# Altium project Jupiter.PrjPcb
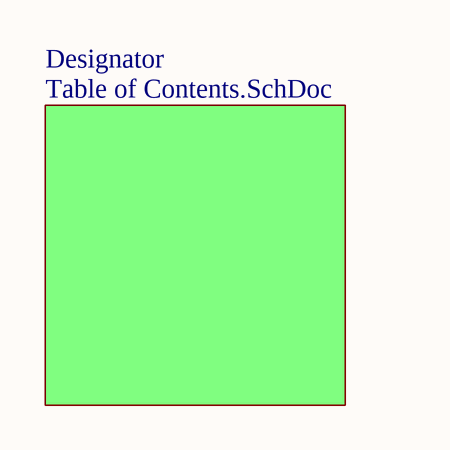
[diagram p0: Title Sheet.SchDoc]
9 sheets, 59 parts. Net scope: flat (ports and power ports of the same name join across sheets).
Board file: Jupiter PCB.PcbDoc
Sheets:
  Title Sheet.SchDoc
    Designator = Table of Contents.SchDoc
      Designator = Power Block Diagram.SchDoc
        Designator = Signal Block Diagram.SchDoc
          Designator = SOC nRF52832.SchDoc
          Designator = Sensors.SchDoc
          Designator = LED & Button.SchDoc
          Designator = Power Supply.SchDoc
          Designator = RTC.SchDoc

## Sheet Title Sheet.SchDoc
size A

### Sub-sheets
Designator = Table of Contents.SchDoc: no entries

## Sheet Table of Contents.SchDoc
size A
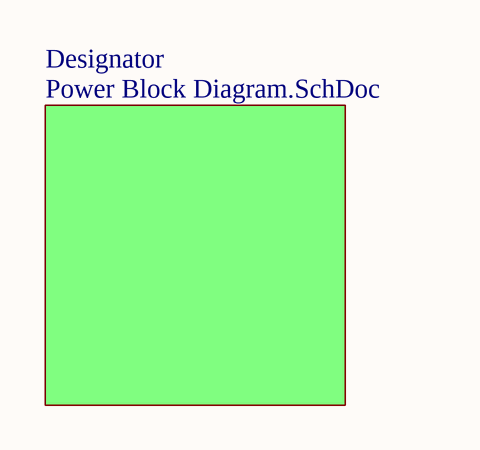
[diagram p1: Table of Contents.SchDoc]

### Sub-sheets
Designator = Power Block Diagram.SchDoc: no entries

## Sheet Power Block Diagram.SchDoc
size A
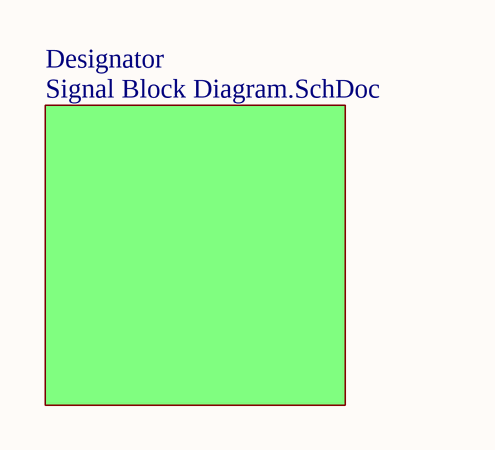
[diagram p2: Power Block Diagram.SchDoc]

### Sub-sheets
Designator = Signal Block Diagram.SchDoc: no entries

## Sheet Signal Block Diagram.SchDoc
size A
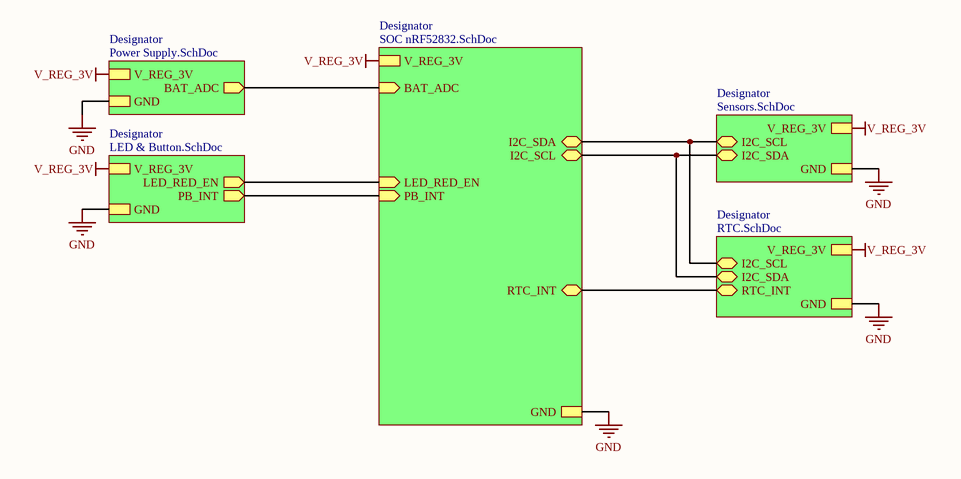
[diagram p3: Signal Block Diagram.SchDoc]

### Sub-sheets
Designator = SOC nRF52832.SchDoc: BAT_ADC (in), PB_INT (in), GND, V_REG_3V, I2C_SDA (bidir), I2C_SCL (bidir), RTC_INT (bidir), LED_RED_EN (in)
Designator = Sensors.SchDoc: GND, I2C_SDA (bidir), V_REG_3V, I2C_SCL (bidir)
Designator = LED & Button.SchDoc: GND, LED_RED_EN (out), PB_INT (out), V_REG_3V
Designator = Power Supply.SchDoc: GND, V_REG_3V, BAT_ADC (out)
Designator = RTC.SchDoc: GND, I2C_SDA (bidir), I2C_SCL (bidir), V_REG_3V, RTC_INT (bidir)

### Nets
GND: sheet Designator/GND, sheet Designator/GND, sheet Designator/GND, sheet Designator/GND, sheet Designator/GND
V_REG_3V: sheet Designator/V_REG_3V, sheet Designator/V_REG_3V, sheet Designator/V_REG_3V, sheet Designator/V_REG_3V, sheet Designator/V_REG_3V
(unnamed): sheet Designator/BAT_ADC, sheet Designator/BAT_ADC
(unnamed): sheet Designator/PB_INT, sheet Designator/PB_INT
(unnamed): sheet Designator/I2C_SDA, sheet Designator/I2C_SCL, sheet Designator/I2C_SCL
(unnamed): sheet Designator/I2C_SCL, sheet Designator/I2C_SDA, sheet Designator/I2C_SDA
(unnamed): sheet Designator/RTC_INT, sheet Designator/RTC_INT
(unnamed): sheet Designator/LED_RED_EN, sheet Designator/LED_RED_EN

## Sheet SOC nRF52832.SchDoc
size B
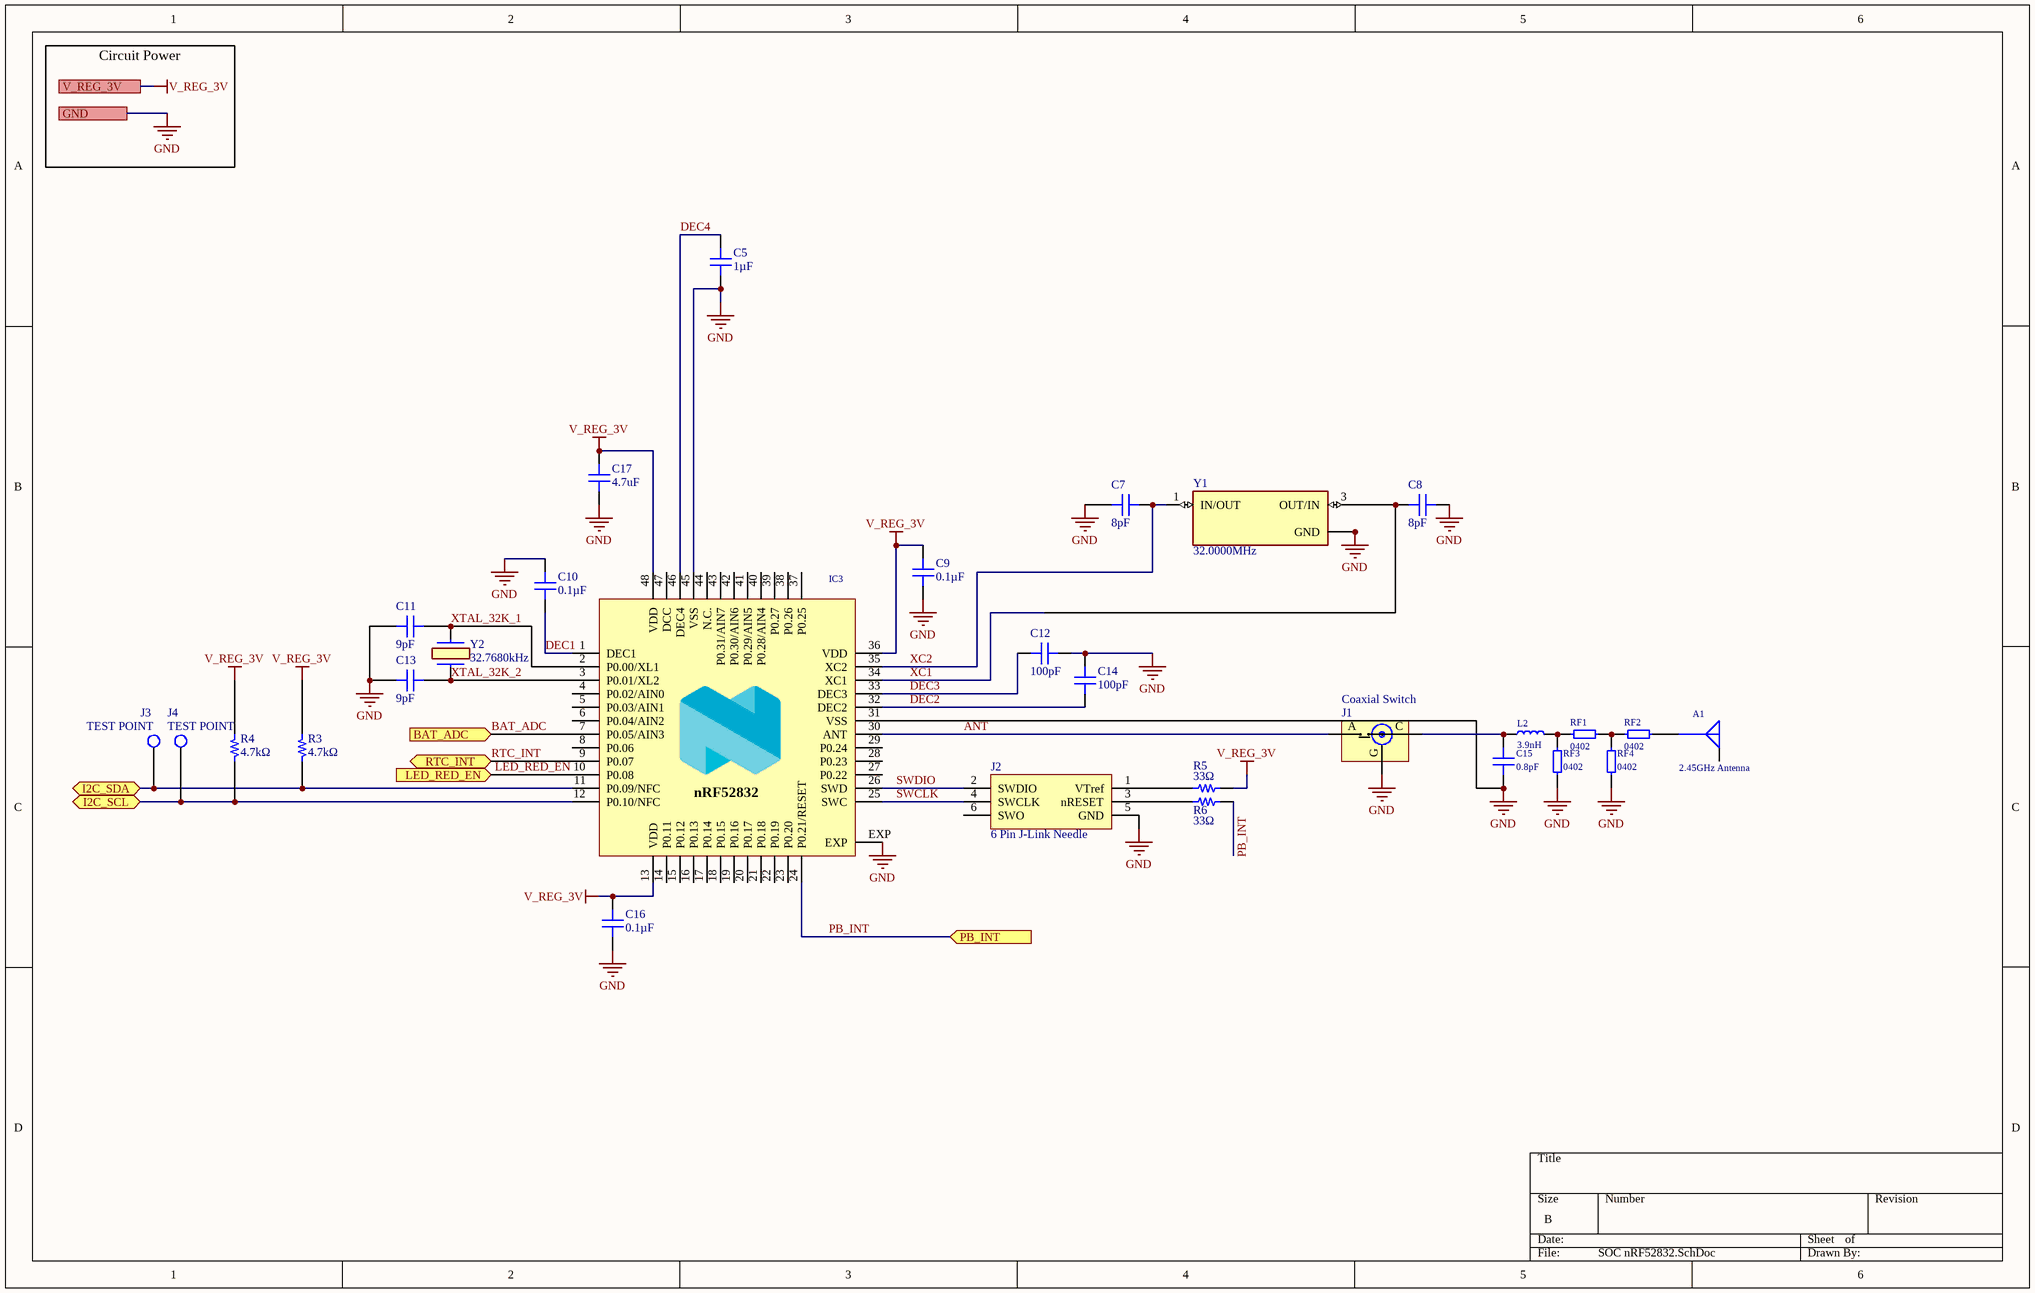
[diagram p4: SOC nRF52832.SchDoc]

### Parts
A1  2.45GHz Antenna  [FRACTUS ANTENNAS FR01-S1-N-0-102]
C5  1µF  [CAP 0402_1005 RF]
C7  8pF  [CAP 0402_1005]
C8  8pF  [CAP 0402_1005]
C9  0.1µF  [CAP 0402_1005]
C10  0.1µF  [CAP 0402_1005]
C11  9pF  [CAP 0402_1005]
C12  100pF  [CAP 0402_1005]
C13  9pF  [CAP 0402_1005]
C14  100pF  [CAP 0402_1005]
C15  0.8pF  [CAP 0603_1608]
C16  0.1µF  [CAP 0402_1005]
C17  4.7uF  [CAP 0402_1005]
IC3  RF SoC  [NORDIC QFN-48]  (value not drawn)
J1  Coaxial Switch  [HIROSE MS-156HF(01)]
J2  6 Pin J-Link Needle  [J-LINK 6-PIN NEEDLE]  (no BOM)
J3  TEST POINT  [TEST POINT]
J4  TEST POINT  [TEST POINT]
L2  3.9nH  [IND 0402_1005]
R3  4.7kΩ  [RES 0402_1005 RF]
R4  4.7kΩ  [RES 0402_1005 RF]
R5  33Ω  [RES 0201_0603]
R6  33Ω  [RES 0201_0603]
RF1  0402  [0402_1005 RF]  (no BOM)
RF2  0402  [0402_1005 RF]  (no BOM)
RF3  0402  [0402_1005 RF]  (no BOM)
RF4  0402  [0402_1005 RF]  (no BOM)
Y1  32.0000MHz  [ECS 320-8-37B]
Y2  32.7680kHz  [EPSON FC135R]

### Ports
BAT_ADC (in), GND, I2C_SCL (bidir), I2C_SDA (bidir), LED_RED_EN (in), PB_INT (in), RTC_INT (bidir), V_REG_3V

### Nets
GND: C5.1 C7.1 C8.2 C9.1 C10.2 C11.1 C12.2 C13.1 C14.2 C15.1 C16.1 C17.1 IC3.31(VSS) IC3.45(VSS) IC3.EXP J1.G J2.5(GND) RF3.1 RF4.1 Y1.2(GND) Y1.4(GND) ; port GND
V_REG_3V: C9.2 C16.2 C17.2 IC3.13(VDD) IC3.36(VDD) IC3.48(VDD) R3.2 R4.2 R5.2 ; port V_REG_3V
ANT: IC3.30(ANT) J1.A
BAT_ADC: IC3.7(P0.05/AIN3) ; port BAT_ADC
DEC1: C10.1 IC3.1(DEC1)
DEC2: C14.1 IC3.32(DEC2)
DEC3: C12.1 IC3.33(DEC3)
DEC4: C5.2 IC3.46(DEC4)
I2C_SCL: IC3.12(P0.10/NFC) J4.1(PAD) R4.1 ; port I2C_SCL
I2C_SDA: IC3.11(P0.09/NFC) J3.1(PAD) R3.1 ; port I2C_SDA
LED_RED_EN: IC3.10(P0.08) ; port LED_RED_EN
PB_INT: IC3.24(P0.21/RESET) R6.2 ; port PB_INT
RTC_INT: IC3.9(P0.07) ; port RTC_INT
SWCLK: IC3.25(SWC) J2.4(SWCLK)
SWDIO: IC3.26(SWD) J2.2(SWDIO)
XC1: C8.1 IC3.34(XC1) Y1.3(OUT/IN)
XC2: C7.2 IC3.35(XC2) Y1.1(IN/OUT)
XTAL_32K_1: C11.2 IC3.2(P0.00/XL1) Y2.1(CRYSTAL_1)
XTAL_32K_2: C13.2 IC3.3(P0.01/XL2) Y2.2(CRYSTAL_2)
NetA1_S: A1.S RF2.2
NetC15_2: C15.2 J1.C L2.1
NetJ2_1: J2.1(VTref) R5.1
NetJ2_3: J2.3(nRESET) R6.1
NetL2_2: L2.2 RF1.1 RF3.2
NetRF1_2: RF1.2 RF2.1 RF4.2

Not connected (* = marked no-connect by the designer): A1 G; IC3 4(P0.02/AIN0) 5(P0.03/AIN1) 6(P0.04/AIN2) 8(P0.06) 14(P0.11) 15(P0.12) 16(P0.13) 17(P0.14) 18(P0.15) 19(P0.16) 20(P0.17) 21(P0.18) 22(P0.19) 23(P0.20) 27(P0.22) 28(P0.23) 29(P0.24) 37(P0.25) 38(P0.26) 39(P0.27) 40(P0.28/AIN4) 41(P0.29/AIN5) 42(P0.30/AIN6) 43(P0.31/AIN7) 44(N.C.) 47(DCC); J2 6(SWO)

### Notes on the sheet
- Circuit Power
- (in symbol SOC00001) nRF52832

### Library data of the parts
A1 = ANT00000: COMPACT REACH XTEND - 102; Manufacturer: Ignion; Manufacturer P/N: NN01-102; RF Family/Standard: 802.15.4, Bluetooth, WiFi; Frequency Group: UHF (2GHz ~ 3GHz); Frequency Range: 2.4GHz ~ 2.5GHz; Antenna Type: Chip; VSWR: 2; Gain: 1.7dBi; Device ID: ANT00000; VALUE: 2.45GHz Antenna; Mounting Type: Surface Mount; Part Type: Chip; Operating Temperature: -40°C ~ 125°C; Package: 7mm; Frequency (Center/Band): 2.45GHz; Return Loss: -; Supplier1: Digi-Key; Supplier1 P/N: 2115-NN01-102CT-ND; Supplier2: Mouser; Supplier2 P/N: 128-NN01-102
C5 = CAP00027: CAP CER 1UF 10V X7S 0402; Manufacturer: Murata Electronics; Manufacturer P/N: GCM155C71A105ME38D; Tolerance: ±20%; Device ID: CAP00027; Mounting Type: Surface Mount; Part Type: Capacitor; VALUE: 1µF; Operating Temperature: -55°C ~ 125°C; Voltage: 10V; Package: 0402 (1005 Metric); Supplier1: Digi-Key; Supplier1 P/N: 490-18202-1-ND; Supplier2: Mouser; Supplier2 P/N: 81-GCM155C71A105ME8D; Temperature Coefficient: X7S
C7 C8 = CAP00054: CAP CER 8PF 50V NPO 0402; Manufacturer: Walsin; Manufacturer P/N: 0402N9R0B500CT; Tolerance: ±0.1%; Temperature Coefficient: C0G, NP0; Device ID: CAP00054; Mounting Type: Surface Mount; Part Type: Capacitor; VALUE: 8pF; Operating Temperature: -55°C ~ 125°C; Voltage: 50V; Package: 0402 (1005 Metric); Supplier1: Digi-Key; Supplier1 P/N: 1292-0402N9R0B500CTTR-ND; Supplier2: Mouser; Supplier2 P/N: 791-0402N9R0B500CT
C9 C10 C16 = CAP00001: CAP CER 0.1UF 16V X7R 0402; Manufacturer: KEMET; Manufacturer P/N: C0402C104K4RAC7411; Tolerance: ±10%; Device ID: CAP00001; Mounting Type: Surface Mount; Part Type: Capacitor; VALUE: 0.1µF; Operating Temperature: -55°C ~ 125°C; Voltage: 16V; Package: 0402 (1005 Metric); Supplier1: Digi-Key; Supplier1 P/N: 399-C0402C104K4RAC7411CT-ND; Supplier2: Mouser; Supplier2 P/N: 80-C0402C104K4R7411; Temperature Coefficient: X7R
C11 C13 = CAP0004E: CAP CER 9PF 50V NPO 0402; Manufacturer: Walsin; Manufacturer P/N: 0402N9R0B500CT; Tolerance: ±0.1%; Temperature Coefficient: C0G, NP0; Device ID: CAP0004E; Mounting Type: Surface Mount; Part Type: Capacitor; VALUE: 9pF; Operating Temperature: -55°C ~ 125°C; Voltage: 50V; Package: 0402 (1005 Metric); Supplier1: Digi-Key; Supplier1 P/N: 1292-0402N9R0B500CTTR-ND; Supplier2: Mouser; Supplier2 P/N: 791-0402N9R0B500CT
C12 C14 = CAP00000: CAP CER 100PF 16V C0G/NP0 0402; Manufacturer: KEMET; Manufacturer P/N: C0402C101K4GACTU; Tolerance: ±10%; Temperature Coefficient: C0G, NP0; Device ID: CAP00000; Mounting Type: Surface Mount; Part Type: Capacitor; VALUE: 100pF; Operating Temperature: -55°C ~ 125°C; Voltage: 16V; Package: 0402 (1005 Metric); Supplier1: Digi-Key; Supplier1 P/N: 399-7749-1-ND; Supplier2: Mouser; Supplier2 P/N: 80-C0402C101K4G
C15 = CAP0004D: CAP CER 0.8PF 50V NP0  0603; Manufacturer: Walsin; Manufacturer P/N: 0603N0R8C500CT; Tolerance: ±0.25pF; Temperature Coefficient: C0G, NP0; Device ID: CAP0004D; Mounting Type: Surface Mount; Part Type: Capacitor; VALUE: 0.8pF; Operating Temperature: -55°C ~ 125°C; Voltage: 50V; Package: 0603 (1608 Metric); Supplier2: Mouser; Supplier2 P/N: 791-0603N0R8C500CT
C17 = CAP00055: CAP CER 8PF 50V NPO 0402; Manufacturer: Samsung Electro-Mechanics; Manufacturer P/N: CL05A475KQ5NRNC; Voltage: 10V; Tolerance: ±10%; Temperature Coefficient: X5R; Device ID: CAP00055; Mounting Type: Surface Mount; Part Type: Capacitor; VALUE: 4.7uF; Operating Temperature: -55°C ~ 125°C; Package: 0402 (1005 Metric); Supplier1: Digi-Key; Supplier1 P/N: 187-CL05A475KQ5NRNC; Supplier2: Mouser; Supplier2 P/N: 187-CL05A475KQ5NRNC
IC3 = SOC00001: IC RF TXRX+MCU BLUETOOTH 48VFQFN; Manufacturer: Nordic Semiconductor; Manufacturer P/N: nRF52832-QFAA-R; Current - Transmitting: 5.5mA ~ 15.2mA; Voltage Supply: 1.7V ~ 3.6V; Sensitivity: -96dBm; Power Output: 4dBm; Frequency: 2.4GHz; Data Rate (Max): 2Mbps; Current - Receiving: 5.5mA ~ 10.4mA; GPIO: 32; Memory Size: 512kB Flash, 64kB RAM; Device ID: SOC00001; Part Type: IC; VALUE: RF SoC; Operating Temperature: -40°C ~ 85°C; Package: QFN-48; Supplier1: Digi-Key; Supplier1 P/N: 1490-1052-1-ND; Supplier2: Digi-Key; Supplier2 P/N: 1490-1067-1-ND; Mounting Type: Surface Mount; Supplier3: Mouser; Supplier3 P/N: 949-NRF52832-QFAA-R7
J1 = RFC00001: CONN COAX SWITCH RCPT STR 50OHM; Manufacturer: Hirose Electric Co Ltd; Manufacturer P/N: MS-156HF(01); Connector Type: Receptacle, Female Socket; Contact Termination: Solder; Impedance: 50Ω; Mating Cycles: 100; Frequency - Max: 6GHz; Device ID: RFC00001; VALUE: Coaxial Switch; Mounting Type: Surface Mount; Part Type: RF Connector; Operating Temperature: -40°C ~ 85°C; Package: Coaxial Switch; Connector Style: MS-156HF(01); Shield Termination: Solder; Cable Group: -; Fastening Type: Snap-On; Supplier1: Digi-Key; Supplier1 P/N: H11669-ND; Supplier2: Mouser; Supplier2 P/N: 798-MS156HF01
J2 = J-LINK 6-PIN NEEDLE ADAPTER: Device ID: CON00004; Connector Type: Board; Style: On-Board; Number of Positions: 6; Number of Positions Loaded: All; Pitch - Mating: 0.050" (1.27mm); VALUE: 6 Pin J-Link Needle; Mounting Type: Board Connector; Part Type: Header; Manufacturer: -; Manufacturer P/N: -; Operating Temperature: -; Package: N/A; Contact Type: Pogo-Pins; Fastening Type: -; Contact Finish - Mating: -; Insulation Color: -; Material Flammability Rating: -; Current Rating (Amps): -; Voltage Rating: -; Supplier1: -; Supplier1 P/N: -; Supplier2: -; Supplier2 P/N: --
J3 J4 = -: Device ID: CON00015; Connector Type: Pad; Number of Positions: 1; Number of Positions Loaded: All; VALUE: Test Point; Mounting Type: Surface Mount; Part Type: Header; Manufacturer: -; Manufacturer P/N: -; Operating Temperature: -; Package: -; Contact Type: Pad; Style: Pad; Pitch - Mating: -; Fastening Type: -; Contact Finish - Mating: Gold; Insulation Color: -; Material Flammability Rating: -; Current Rating (Amps): -; Voltage Rating: -; Supplier1: -; Supplier1 P/N: -; Supplier2: -; Supplier2 P/N: -
L2 = IND00004: FIXED IND 3.9NH 250MA 450MOHM SM; Manufacturer: KYOCERA AVX; Manufacturer P/N: L04023R9BHNTR; Tolerance: ±0.1%; DC Resistance: 0.460Ω; Q @ Freq: 13 @ 450MHz; Material - Core: Non-Magnetic; Frequency - Self Resonant: 8GHz; Device ID: IND00004; Part Type: Inductor; VALUE: 3.9nH; Operating Temperature: -55°C ~ 125°C; Current Saturation: -; Package: 0402 (1005 Metric); Supplier1: Digi-Key; Supplier1 P/N: 478-4199-2-ND; Supplier2: Mouser; Supplier2 P/N: 581-L04023R9BHNTR; Mounting Type: Surface Mount
R3 R4 = RES0003B: RES SMD 4.7K OHM 1% 1/8W 0402; Manufacturer: YAGEO; Manufacturer P/N: AC0402FR-7W4K7L; Power: 0.125W; Device ID: RES0003B; VALUE: 4.7kΩ; Mounting Type: Surface Mount; Part Type: Resistor; Operating Temperature: -55°C ~ 155°C; Package: 0402 (1005 Metric); Tolerance: ±1%; Composition: Thick Film; Supplier1: Digi-Key; Supplier1 P/N: 603-AC0402FR-7W4K7L; Supplier2: Mouser; Supplier2 P/N: 603-AC0402FR-7W4K7L
R5 R6 = RES0003A: RES SMD 33 OHM 1% 1/20W 0201; Manufacturer: Vishay Dale; Manufacturer P/N: CRCW020110R0FNED; Power: 0.050W; Device ID: RES0003A; VALUE: 33Ω; Mounting Type: Surface Mount; Part Type: Resistor; Operating Temperature: -55°C ~ 155°C; Package: 0201 (0603 Metric); Tolerance: ±1%; Composition: Thick Film; Supplier1: Digi-Key; Supplier1 P/N: 541-10.0ABCT-ND; Supplier2: Mouser; Supplier2 P/N: 71-CRCW020110R0FNED
RF1-RF4 = RFP00000: 0402 RF Passive; Device ID: RFP00000; VALUE: 0402; Mounting Type: Surface Mount; Part Type: Passive
Y1 = XTL00005: CRYSTAL 32.0000MHZ 8PF SMD; Manufacturer: ECS; Manufacturer P/N: ECS-320-8-37B-7KM-TR3; Tolerance: ±7ppm; Operating Mode: Fundamental; ESR: 50Ω; Device ID: XTL00005; Part Type: XTAL; VALUE: 32.0000MHz; Operating Temperature: -20°C ~ 70°C; Load Capacitance: 8pF; Package: 4-SMD, No Lead; Supplier1: Digi-Key; Supplier1 P/N: 50-ECS-320-8-37B-7KM-TR3TR-ND; Supplier2: Mouser; Supplier2 P/N: 520-ECS320837B7KMTR3 / 729-G43270021; Mounting Type: Surface Mount
Y2 = XTL00004: CRYSTAL 32.7680KHZ 9PF SMD; Manufacturer: EPSON; Manufacturer P/N: FC-135R 32.7680KF-AC3; Tolerance: ±10ppm; Operating Mode: Fundamental; ESR: 50kΩ; Device ID: XTL00004; Part Type: XTAL; VALUE: 32.7680kHz; Operating Temperature: -20°C ~ 70°C; Load Capacitance: 9pF; Package: 2-SMD, No Lead; Supplier1: Digi-Key; Supplier1 P/N: SER4075TR-ND; Supplier2: Mouser; Supplier2 P/N: 732-5R32.7680KF-AC3 / 729-G43270021; Mounting Type: Surface Mount

## Sheet Sensors.SchDoc
size A
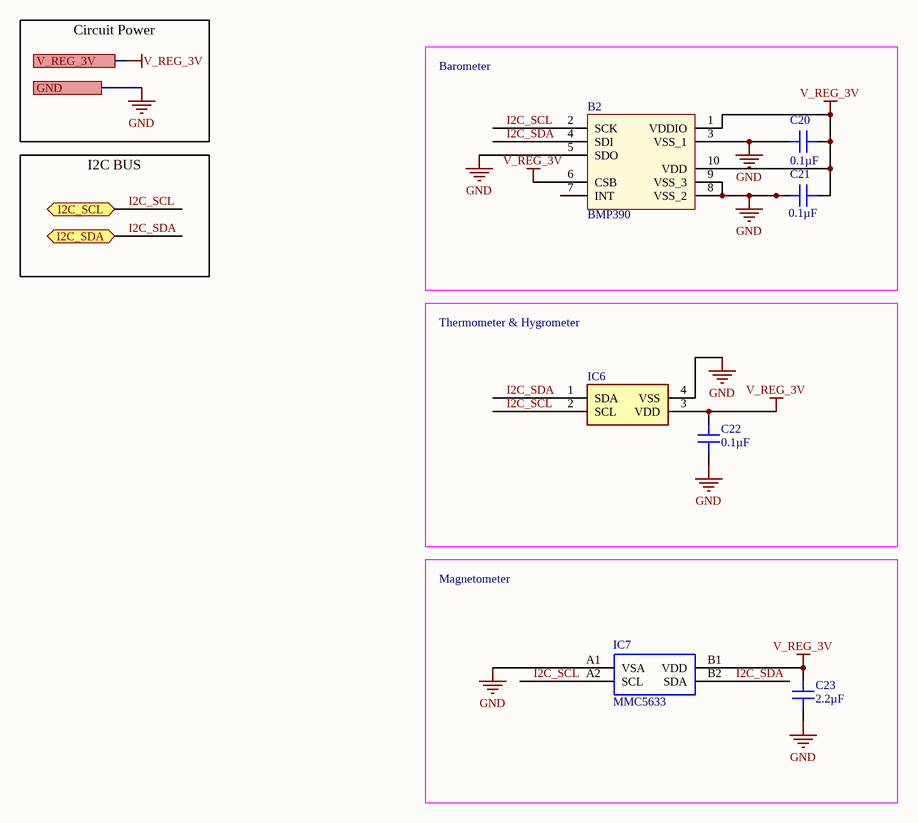
[diagram p5: Sensors.SchDoc]

### Parts
B2  BMP390  [BMP390]
C20  0.1µF  [CAP 0603_1608 RF]
C21  0.1µF  [CAP 0603_1608 RF]
C22  0.1µF  [CAP 0402_1005]
C23  2.2µF  [CAP 0402_1005 RF]
IC6  -40°C ~ 125°C Temp Sense  [SENSIRION SHT45]  (value not drawn)
IC7  MMC5633  [MEMSIC MMC5633]

### Blocks framed on the sheet
Barometer: B2 C20 C21
Thermometer & Hygrometer: C22 IC6
Magnetometer: C23 IC7

### Ports
GND, I2C_SCL (bidir), I2C_SDA (bidir), V_REG_3V

### Nets
GND: B2.3(VSS_1) B2.5(SDO) B2.8(VSS_2) B2.9(VSS_3) C20.1 C21.1 C22.1 C23.1 IC6.4(VSS) IC7.A1(VSA) ; port GND
V_REG_3V: B2.1(VDDIO) B2.6(CSB) B2.10(VDD) C20.2 C21.2 C22.2 C23.2 IC6.3(VDD) IC7.B1(VDD) ; port V_REG_3V
I2C_SCL: B2.2(SCK) IC6.2(SCL) IC7.A2(SCL) ; port I2C_SCL
I2C_SDA: B2.4(SDI) IC6.1(SDA) IC7.B2(SDA) ; port I2C_SDA

Not connected (* = marked no-connect by the designer): B2 7(INT)

### Notes on the sheet
- Circuit Power
- I2C BUS

### Library data of the parts
B2 = TMP00004: PRESSURE; Manufacturer_Name: Bosch Sensortec; Manufacturer: BOSCH; Geometry.Height: 0.8mm; VALUE: -40°C ~ 125°C Temp Sense; Sensor Type: Digital, Local; Sensing Temperature - Local: -40°C ~ 125°C; Output Type: I²C/SMBus; Voltage - Supply: 1.08V ~ 3.6V; Resolution: 16B; Accuracy - Highest (Lowest): ±2°C (±3°C); Test Condition: -10°C ~ 100°C (-40°C ~ 125°C); Mouser Part Number: 262-BMP390; Mouser Price/Stock: https://www.mouser.co.uk/ProductDetail/Bosch-Sensortec/BMP390?qs=QNEnbhJQKvYQVfvRMgo2YA%3D%3D; Manufacturer_Part_Number: BMP390; Datasheet Link: https://www.bosch-sensortec.com/media/boschsensortec/downloads/datasheets/bst-bmp390-ds002.pdf; Device ID: TMP00004; Part Type: IC; Manufacturer P/N: BMP390; Operating Temperature: -40°C ~ 125°C; Package: 10-DFN; Mounting Type: Surface Mount; Sensing Temperature - Remote: -; Features: One-Shot, Shutdown Mode; Supplier1: Digi-Key; Supplier1 P/N: 403-SHT45-AD1B-R3; Supplier2: Mouser; Supplier2 P/N: 1649-SHT45-AD1B-R3TR-ND
C20 C21 = CAP00039: CAP CER 0.1UF 16V X7R 0603; Manufacturer: KEMET; Manufacturer P/N: C0603C104M4RACAUTO; Tolerance: ±20%; Device ID: CAP00039; Mounting Type: Surface Mount; Part Type: Capacitor; VALUE: 0.1µF; Operating Temperature: -55°C ~ 125°C; Voltage: 16V; Package: 0603 (1608 Metric); Supplier1: Digi-Key; Supplier1 P/N: 399-C0603C104M4RACAUTOCT-ND; Supplier2: Mouser; Supplier2 P/N: C0603C104M4RACAUTO; Temperature Coefficient: X7R
C22 = CAP00001: as C9 on sheet SOC nRF52832; Device ID: CAP00001; Mounting Type: Surface Mount; Part Type: Capacitor; VALUE: 0.1µF; Operating Temperature: -55°C ~ 125°C; Voltage: 16V; Package: 0402 (1005 Metric); Supplier1: Digi-Key; Supplier1 P/N: 399-C0402C104K4RAC7411CT-ND; Supplier2: Mouser; Supplier2 P/N: 80-C0402C104K4R7411; Temperature Coefficient: X7R
C23 = CAP00028: CAP CER 2.2UF 10V X7S 0402; Manufacturer: Murata Electronics; Manufacturer P/N: GRT155C71A225KE13D; Tolerance: ±10%; Device ID: CAP00028; Mounting Type: Surface Mount; Part Type: Capacitor; VALUE: 2.2µF; Operating Temperature: -55°C ~ 125°C; Voltage: 10V; Package: 0402 (1005 Metric); Supplier1: Digi-Key; Supplier1 P/N: 490-16304-1-ND; Supplier2: Mouser; Supplier2 P/N: 81-GRT155C71A225KE3D; Temperature Coefficient: X7S
IC6 = TMP00003: SENSOR HUMID/TEMP HIGH ACCURACY; Manufacturer: Sensirion AG; Manufacturer P/N: SHT45-AD1B-R3; Sensor Type: Digital, Local; Output Type: I²C/SMBus; Voltage - Supply: 1.08V ~ 3.6V; Resolution: 16B; Accuracy - Highest (Lowest): ±2°C (±3°C); Test Condition: -10°C ~ 100°C (-40°C ~ 125°C); Device ID: TMP00003; Part Type: IC; VALUE: -40°C ~ 125°C Temp Sense; Operating Temperature: -40°C ~ 125°C; Package: 4-DFN; Mounting Type: Surface Mount; Sensing Temperature - Local: -40°C ~ 125°C; Sensing Temperature - Remote: -; Features: One-Shot, Shutdown Mode; Supplier1: Digi-Key; Supplier1 P/N: 403-SHT45-AD1B-R3; Supplier2: Mouser; Supplier2 P/N: 1649-SHT45-AD1B-R3TR-ND
IC7 = MAG00002: 30 GAUSS, MONOLITHIC, HIGH PERFO; Manufacturer: MEMSIC; Manufacturer P/N: MMC5633NJL; VALUE: Magnetoresistive Sensor X, Y, Z Axis; Axis: Triple; Output Type: I²C; Sensing Range: ±3mT; Voltage - Supply: 1.62V ~ 3.6V; Current - Supply (Max): 0.4µA (Typ); Resolution: 20b; Bandwidth: 1kKz; Device ID: MAG00002; Part Type: IC; Package: BGA-2x2; Mounting Type: Surface Mount; Operating Temperature: -40°C ~ 125°C (TA); Technology: Hall Effect; Current - Output (Max): -; Features: Temperature Compensated; Supplier1: Digi-Key; Supplier1 P/N: 1267-MMC5633NJLTR-ND; Supplier2: Mouser; Supplier2 P/N: 438-MMC5633NJL

## Sheet LED & Button.SchDoc
size A
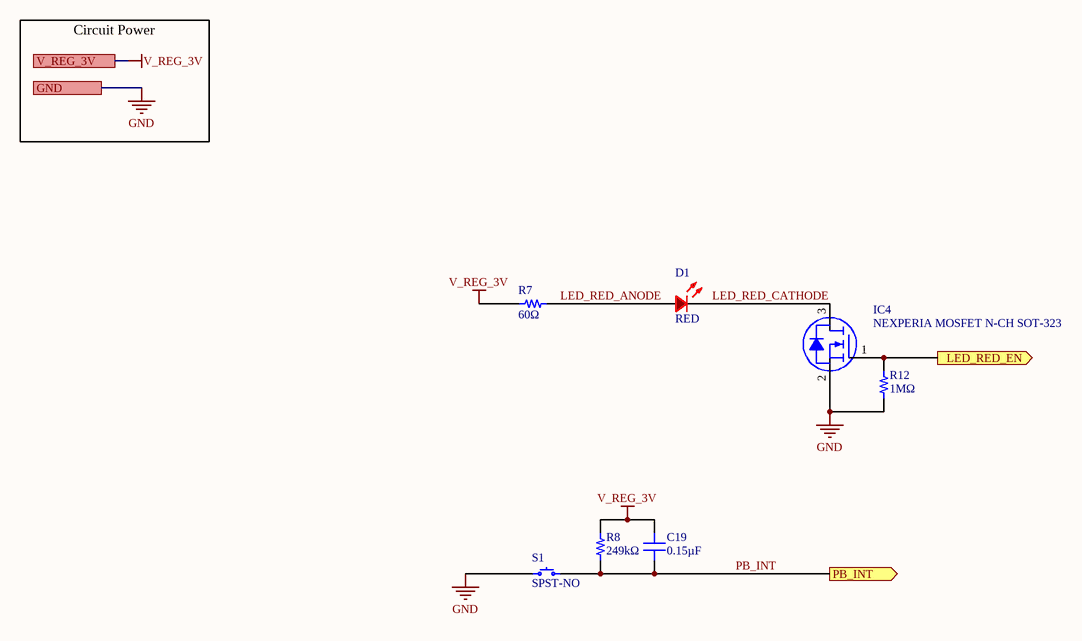
[diagram p6: LED & Button.SchDoc]

### Parts
C19  0.15µF  [CAP 0603_1608]
D1  RED  [LED 0603_1608]
IC4  NEXPERIA MOSFET N-CH SOT-323  [NEXPERIA SOT-323]
R7  60Ω  [RES 0603_1608 RF]
R8  249kΩ  [RES 0603_1608 RF]
R12  1MΩ  [RES 0603_1608 RF]
S1  SPST-NO  [PANASONIC EVP-AA002K]

### Ports
GND, LED_RED_EN (out), PB_INT (out), V_REG_3V

### Nets
GND: IC4.2(S) R12.1 S1.1 ; port GND
V_REG_3V: C19.2 R7.1 R8.2 ; port V_REG_3V
LED_RED_ANODE: D1.1 R7.2
LED_RED_CATHODE: D1.2 IC4.3(D)
LED_RED_EN: IC4.1(G) R12.2 ; port LED_RED_EN
PB_INT: C19.1 R8.1 S1.2 ; port PB_INT

### Notes on the sheet
- Circuit Power

### Library data of the parts
C19 = CAP00008: CAP CER 0.15UF 10V X7R 0603; Manufacturer: KEMET; Manufacturer P/N: C0603C154K8RACTU; Tolerance: ±10%; Device ID: CAP00008; Mounting Type: Surface Mount; Part Type: Capacitor; VALUE: 0.15µF; Operating Temperature: -55°C ~ 125°C; Voltage: 10V; Package: 0603 (1608 Metric); Supplier1: Digi-Key; Supplier1 P/N: 399-7862-1-ND; Supplier2: Mouser; Supplier2 P/N: 80-C0603C154K8R; Temperature Coefficient: X7R
D1 = LED0000A: LED RED CLEAR 0603 SMD; Manufacturer: Würth Elektronik; Manufacturer P/N: 150060RS75000; If - Forward Current: 100mA; Vf - Forward Voltage: 2.0V; Wavelength: 625nm; Viewing Angle: 140°; Lens Color: Colorless; Device ID: LED0000A; VALUE: RED; Mounting Type: Surface Mount; Part Type: LED; Operating Temperature: -40°C ~ 85°C; Package: 0603 (1608 Metric); Color: Red; Supplier1: Digi-Key; Supplier1 P/N: 732-4978-1-ND
IC4 = MOS00000: MOSFET N-CH 60V 320MA SOT323; Manufacturer: Nexperia USA Inc.; Manufacturer P/N: BSS138PW,115; FET Type: N-Channel; VALUE: NFET; Current - Continuous Drain (Id) @ 25°C: 320mA (Ta); Drive Voltage (Max Rds On, Min Rds On): 10V; Rds On (Max) @ Id, Vgs: 1.6Ohm @ 300mA, 10V; Vgs(th) (Max) @ Id: 1.5V @ 250µA; Vgs (Max): ±20V; Power Dissipation (Max): 260mW (Ta), 830mW (Tc); Gate Charge (Qg) (Max) @ Vgs: 0.8 nC @ 4.5 V; Input Capacitance (Ciss) (Max) @ Vds: 50 pF @ 10 V; Device ID: MOS00000; Package: SOT-323; Part Type: IC; Technology: MOSFET (Metal Oxide); FET Feature: -; Operating Temperature: -55°C ~ 150°C (TA); Mounting Type: Surface Mount; Drain to Source Voltage (Vdss): 60V; Supplier1: Digi-Key; Supplier1 P/N: 1727-1143-1-ND; Supplier2: Mouser; Supplier2 P/N: 771-BSS138PW115
R7 = RES00034: RES 60 OHM 1% 1/10W 0603; Manufacturer: Vishay Dale; Manufacturer P/N: ‎CRCW0603820KFKEAC‎; Power: 0.100W; Device ID: RES00034; VALUE: 60Ω; Mounting Type: Surface Mount; Part Type: Resistor; Operating Temperature: -55°C ~ 155°C; Package: 0603 (1608 Metric); Tolerance: ±1%; Composition: Thick Film; Supplier1: Digi-Key; Supplier1 P/N: ‎541-5568-1-ND‎; Supplier2: Mouser; Supplier2 P/N: 71-CRCW0603820KFKEAC
R8 = RES0000A: RES SMD 249K OHM 0.1% 1/10W 0603; Manufacturer: Susumu; Manufacturer P/N: RG1608P-2493-B-T5; Power: 0.100W; Device ID: RES0000A; VALUE: 249kΩ; Mounting Type: Surface Mount; Part Type: Resistor; Operating Temperature: -55°C ~ 155°C; Package: 0603 (1608 Metric); Tolerance: ±0.1%; Composition: Thin Film; Supplier1: Digi-Key; Supplier1 P/N: RG16P249KBCT-ND; Supplier2: Mouser; Supplier2 P/N: 754-RG1608P-2493-BT5
R12 = RES0003E: RES 1M OHM 1% 1/10W 0603; Manufacturer: Vishay Dale; Manufacturer P/N: ‎CRCW0603820KFKEAC‎; Power: 0.100W; Device ID: RES0003E; VALUE: 1MΩ; Mounting Type: Surface Mount; Part Type: Resistor; Operating Temperature: -55°C ~ 155°C; Package: 0603 (1608 Metric); Tolerance: ±1%; Composition: Thick Film; Supplier1: Digi-Key; Supplier1 P/N: ‎541-5568-1-ND‎; Supplier2: Mouser; Supplier2 P/N: 71-CRCW0603820KFKEAC
S1 = BUT00002: SWITCH TACTILE SPST-NO 0.02A 15V; Manufacturer: Panasonic Electronic Components; Manufacturer P/N: EVP-AA002K; Switch Function: Off-Mom; Contact Rating @ Voltage: 0.02A @ 15VDC; Operating Force: 100gf; Device ID: BUT00002; Part Type: Button; VALUE: SPST-NO; Operating Temperature: -40°C ~ 85°C; Package: 4-Lead SMT; Supplier1: Digi-Key; Supplier1 P/N: P13347SCT-ND; Supplier2: Mouser; Supplier2 P/N: 667-EVP-AA002K; Mounting Type: Surface Mount

## Sheet Power Supply.SchDoc
size A
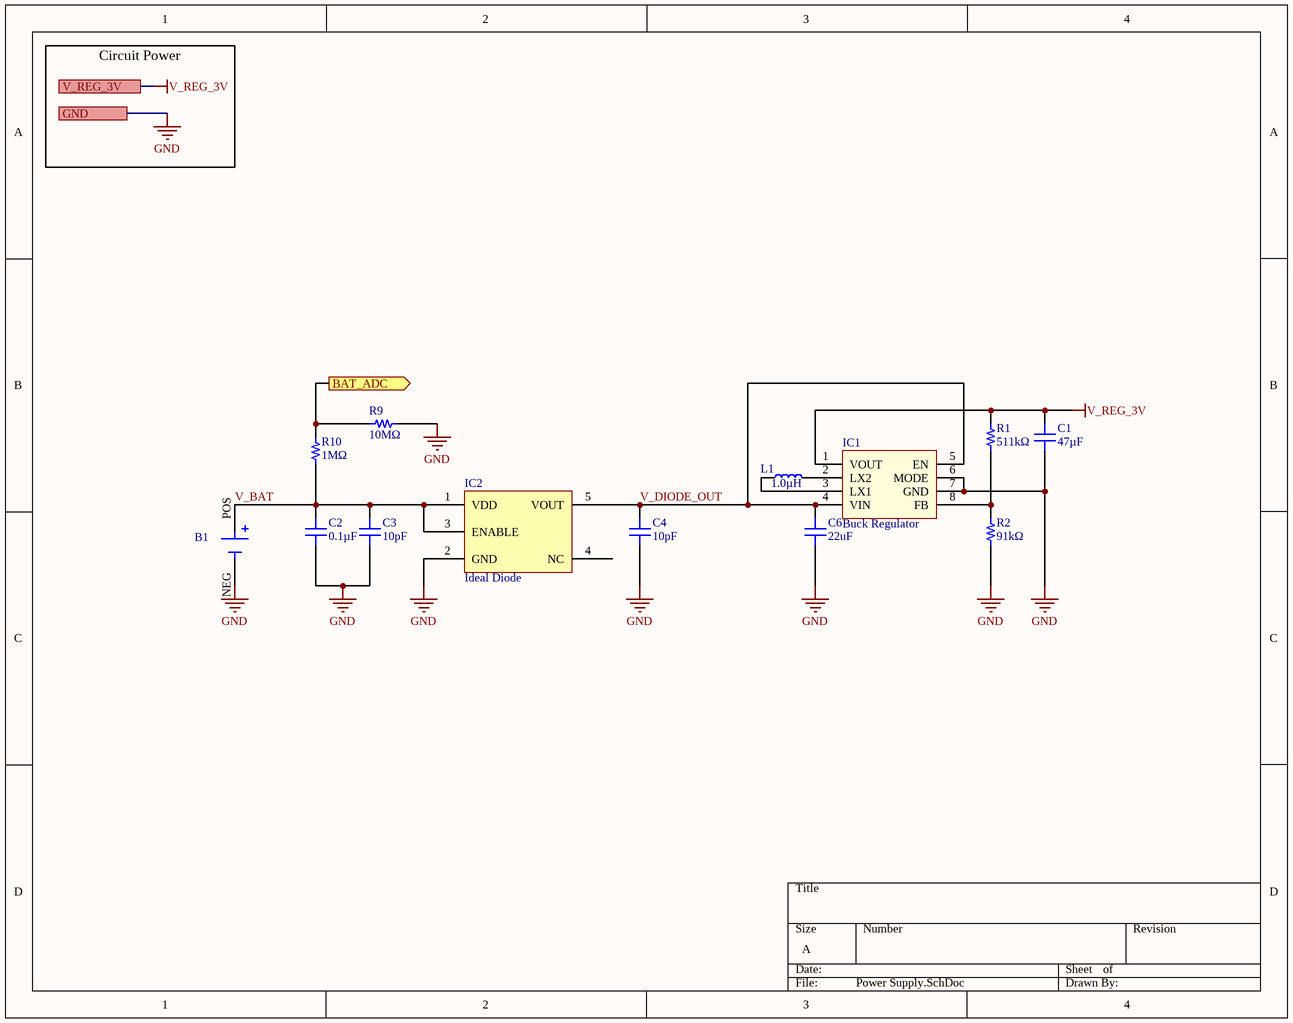
[diagram p7: Power Supply.SchDoc]

### Parts
B1  24.5mm Coin Cell (×1)  [MPD BHAA-3]  (value not drawn)
C1  47µF  [CAP 0805_2012]
C2  0.1µF  [CAP 0402_1005]
C3  10pF  [CAP 0603_1608]
C4  10pF  [CAP 0603_1608]
C6  22uF  [CAP 0402_1005]
IC1  Buck Regulator  [TI SOT-583]
IC2  Ideal Diode  [MAXIM SOT-23-5]
L1  1.0µH  [NTC 0603_1608]
R1  511kΩ  [RES 0402_1005 RF]
R2  91kΩ  [RES 0402_1005 RF]
R9  10MΩ  [RES 0603_1608 RF]
R10  1MΩ  [RES 0603_1608 RF]

### Ports
BAT_ADC (out), GND, V_REG_3V

### Nets
GND: B1.NEG C1.1 C2.1 C3.1 C4.1 C6.1 IC1.6(MODE) IC1.7(GND) IC2.2(GND) R2.1 R9.2 ; port GND
V_REG_3V: C1.2 IC1.1(VOUT) R1.2 ; port V_REG_3V
BAT_ADC: R9.1 R10.2 ; port BAT_ADC
V_BAT: B1.POS C2.2 C3.2 IC2.1(VDD) IC2.3(ENABLE) R10.1
V_DIODE_OUT: C4.2 C6.2 IC1.4(VIN) IC1.5(EN) IC2.5(VOUT)
NetIC1_2: IC1.2(LX2) L1.2
NetIC1_3: IC1.3(LX1) L1.1
NetIC1_8: IC1.8(FB) R1.1 R2.2

Not connected (* = marked no-connect by the designer): IC2 4(NC)

### Notes on the sheet
- Circuit Power

### Library data of the parts
B1 = BCL00006: BATTERY HOLDER AA PIN; Manufacturer: MPD (Memory Protection Devices); Manufacturer P/N: BHAA-3‎; Number of Cells: 1; Style: PC Pin; Device ID: BCL00006; Part Type: Battery Holder; VALUE: 24.5mm Coin Cell (×1); Operating Temperature: -55°C ~ 105°C; Battery Cell Size: AA; Supplier1: Digi-Key; Supplier1 P/N: BHAA-3-ND; Supplier2: -; Supplier2 P/N: -; Mounting Type: Through Hole
C1 = CAP00052: CAP CER 47UF 50V X7R 0805; Manufacturer: KEMET; Manufacturer P/N: C0805C223K5RAC7210; Tolerance: ±20%; Device ID: CAP00052; Mounting Type: Surface Mount; Part Type: Capacitor; VALUE: 47µF; Operating Temperature: -55°C ~ 125°C; Voltage: 50V; Package: 0805 (2012 Metric); Supplier1: Digi-Key; Supplier1 P/N: 399-C0805C223K5RAC7210CT-ND; Supplier2: Mouser; Supplier2 P/N: 80-C0805C223K5RACLR; Temperature Coefficient: X7R
C2 = CAP00001: as C9 on sheet SOC nRF52832; Device ID: CAP00001; Mounting Type: Surface Mount; Part Type: Capacitor; VALUE: 0.1µF; Operating Temperature: -55°C ~ 125°C; Voltage: 16V; Package: 0402 (1005 Metric); Supplier1: Digi-Key; Supplier1 P/N: 399-C0402C104K4RAC7411CT-ND; Supplier2: Mouser; Supplier2 P/N: 80-C0402C104K4R7411; Temperature Coefficient: X7R
C3 C4 = CAP00050: CAP CER 10UF 6.3V X5R 0603; Manufacturer: KEMET; Manufacturer P/N: CL10A106MQ8NNNC; Tolerance: ±20%; Device ID: CAP00050; Mounting Type: Surface Mount; Part Type: Capacitor; VALUE: 10pF; Operating Temperature: -55°C ~ 125°C; Voltage: 6.3V; Package: 0603 (1608 Metric); Supplier1: Digi-Key; Supplier1 P/N: 1276-1119-2-ND; Supplier2: Mouser; Supplier2 P/N: 187-CL10A106MQ8NNNC; Temperature Coefficient: X5R
C6 = CAP00053: CAP CER 22UF 50V NPO 0402; Manufacturer: Walsin; Manufacturer P/N: 0402N9R0B500CT; Tolerance: ±0.1%; Temperature Coefficient: C0G, NP0; Device ID: CAP00053; Mounting Type: Surface Mount; Part Type: Capacitor; VALUE: 22uF; Operating Temperature: -55°C ~ 125°C; Voltage: 50V; Package: 0402 (1005 Metric); Supplier1: Digi-Key; Supplier1 P/N: 1292-0402N9R0B500CTTR-ND; Supplier2: Mouser; Supplier2 P/N: 791-0402N9R0B500CT
IC1 = VRG00007: DC DC CONVERTER; Manufacturer: Texas Instruments; Manufacturer P/N: TPS631000DRLR; Voltage - Input (Max): 5.5V; Voltage - Input (Min): 1.6V; Voltage - Output (Max): 5.3V; Current - Output: 2A; Number of Outputs: 1; Voltage - Output (Min/Fixed): 1.2V; Function: Step-Down; Device ID: VRG00007; Part Type: IC; VALUE: Buck Regulator; Operating Temperature: -40°C ~ 125°C (TJ); Package: SOT-583; Supplier1: Digi-Key; Supplier1 P/N: 296-TPS631000DRLRTR-ND; Synchronous Rectifier: -; Supplier2: Mouser; Supplier2 P/N: 595-TPS631000DRLR; Mounting Type: Surface Mount; Frequency - Switching: -
IC2 = DCN00002: IC IDEAL DIODE; Manufacturer: Texas Instruments; Manufacturer P/N: LM66100DCKR; FET Type: P-Channel; Ratio - Input:Output: 1:1; Internal Switch(s): Yes; Current - Output (Max): 1.5A; Voltage - Supply: 1.5V ~ 5.5V; Delay Time - ON: 27 µs; Delay Time - OFF: 2 µs; Device ID: DCN00002; Part Type: IC; VALUE: Ideal Diode; Operating Temperature: -40°C ~ 105°C; Package: SOT-363; Mounting Type: Surface Mount; Applications: General Purpose; Supplier1: Digi-Key; Supplier1 P/N: 296-53541-1-ND; Supplier2: Mouser; Supplier2 P/N: 595-LM66100DCKR
L1 = IND00005: FIXED IND 1.0UH 16V; Manufacturer: TDK Corporation; Manufacturer P/N: C2012X5R1C106K; Current Saturation: 90mA; Tolerance: ±20%; DC Resistance: 1.050Ω; Material - Core: Ferrite; Device ID: IND00005; Part Type: Inductor; VALUE: 1.0µH; Operating Temperature: -55°C ~ 125°C; Package: 0603 (1608 Metric); Supplier1: Digi-Key; Supplier1 P/N: 445-175588-1-ND; Supplier2: Mouser; Supplier2 P/N: 810-MLZ1608M100WTD25; Q @ Freq: -; Frequency - Self Resonant: -; Mounting Type: Surface Mount
R1 = RES0003C: RES SMD 4.7K OHM 1% 1/8W 0402; Manufacturer: YAGEO; Manufacturer P/N: AC0402FR-7W4K7L; Power: 0.125W; Device ID: RES0003C; VALUE: 511kΩ; Mounting Type: Surface Mount; Part Type: Resistor; Operating Temperature: -55°C ~ 155°C; Package: 0402 (1005 Metric); Tolerance: ±1%; Composition: Thick Film; Supplier1: Digi-Key; Supplier1 P/N: 603-AC0402FR-7W4K7L; Supplier2: Mouser; Supplier2 P/N: 603-AC0402FR-7W4K7L
R2 = RES0003D: RES SMD 4.7K OHM 1% 1/8W 0402; Manufacturer: YAGEO; Manufacturer P/N: AC0402FR-7W4K7L; Power: 0.125W; Device ID: RES0003D; VALUE: 91kΩ; Mounting Type: Surface Mount; Part Type: Resistor; Operating Temperature: -55°C ~ 155°C; Package: 0402 (1005 Metric); Tolerance: ±1%; Composition: Thick Film; Supplier1: Digi-Key; Supplier1 P/N: 603-AC0402FR-7W4K7L; Supplier2: Mouser; Supplier2 P/N: 603-AC0402FR-7W4K7L
R9 = RES0003F: RES 10M OHM 1% 1/10W 0603; Manufacturer: Vishay Dale; Manufacturer P/N: ‎CRCW0603820KFKEAC‎; Power: 0.100W; Device ID: RES0003F; VALUE: 10MΩ; Mounting Type: Surface Mount; Part Type: Resistor; Operating Temperature: -55°C ~ 155°C; Package: 0603 (1608 Metric); Tolerance: ±1%; Composition: Thick Film; Supplier1: Digi-Key; Supplier1 P/N: ‎541-5568-1-ND‎; Supplier2: Mouser; Supplier2 P/N: 71-CRCW0603820KFKEAC
R10 = RES0003E: as R12 on sheet LED & Button; Device ID: RES0003E; VALUE: 1MΩ; Mounting Type: Surface Mount; Part Type: Resistor; Operating Temperature: -55°C ~ 155°C; Package: 0603 (1608 Metric); Tolerance: ±1%; Composition: Thick Film; Supplier1: Digi-Key; Supplier1 P/N: ‎541-5568-1-ND‎; Supplier2: Mouser; Supplier2 P/N: 71-CRCW0603820KFKEAC

## Sheet RTC.SchDoc
size A
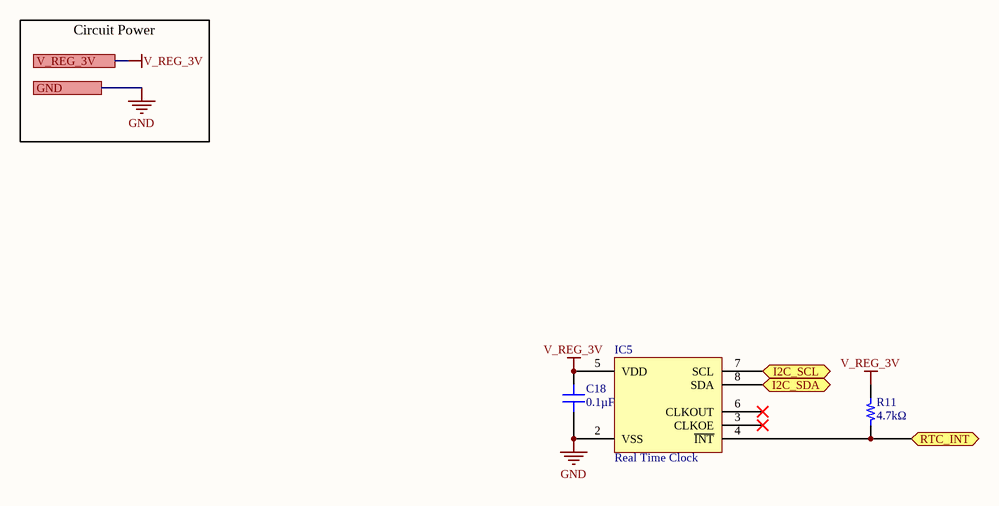
[diagram p8: RTC.SchDoc]

### Parts
C18  0.1µF  [CAP 0402_1005]
IC5  Real Time Clock  [MICRO CRYSTAL 8-SON]
R11  4.7kΩ  [RES 0402_1005 RF]

### Ports
GND, I2C_SCL (bidir), I2C_SDA (bidir), RTC_INT (bidir), V_REG_3V

### Nets
GND: C18.1 IC5.2(VSS) ; port GND
V_REG_3V: C18.2 IC5.5(VDD) R11.2 ; port V_REG_3V
I2C_SCL: IC5.7(SCL) ; port I2C_SCL
I2C_SDA: IC5.8(SDA) ; port I2C_SDA
RTC_INT: IC5.4(~{INT}) R11.1 ; port RTC_INT

Not connected (* = marked no-connect by the designer): IC5 3(CLKOE)* 6(CLKOUT)*

### Notes on the sheet
- Circuit Power

### Library data of the parts
C18 = CAP00001: as C9 on sheet SOC nRF52832; Device ID: CAP00001; Mounting Type: Surface Mount; Part Type: Capacitor; VALUE: 0.1µF; Operating Temperature: -55°C ~ 125°C; Voltage: 16V; Package: 0402 (1005 Metric); Supplier1: Digi-Key; Supplier1 P/N: 399-C0402C104K4RAC7411CT-ND; Supplier2: Mouser; Supplier2 P/N: 80-C0402C104K4R7411; Temperature Coefficient: X7R
IC5 = RTC00001: IC RTC CLK/CALENDAR I2C 8-SMT; Manufacturer: Micro Crystal AG; Manufacturer P/N: RV-8263-C7-32.768KHZ-20PPM-TA-QC; Time Format: HH:MM:SS; Date Format: YY-MM-DD-dd; Interface: I²C; Voltage - Supply: 0.9V ~ 5.5V; Current - Timekeeping Max: 240nA @ 3V; Device ID: RTC00001; Part Type: IC; VALUE: Real Time Clock; Package: 8-SON (3.2x1.5); Operating Temperature: -40°C ~ 85°C; Features: Alarm, Leap Year, RAM; Memory Size: -; Voltage - Supply Battery: -; Supplier1: Digi-Key; Supplier1 P/N: 2195-RV-8263-C7-32.768KHZ-20PPM-TA-QCCT-ND; Supplier2: Mouser; Supplier2 P/N: 428-8263C7328K20PTQC
R11 = RES0003B: as R3 on sheet SOC nRF52832; Device ID: RES0003B; VALUE: 4.7kΩ; Mounting Type: Surface Mount; Part Type: Resistor; Operating Temperature: -55°C ~ 155°C; Package: 0402 (1005 Metric); Tolerance: ±1%; Composition: Thick Film; Supplier1: Digi-Key; Supplier1 P/N: 603-AC0402FR-7W4K7L; Supplier2: Mouser; Supplier2 P/N: 603-AC0402FR-7W4K7L

## Nets that join several sheets
GND: SOC nRF52832 (21 pins), Sensors (10 pins), LED & Button (IC4.2 R12.1 S1.1), Power Supply (11 pins), RTC (C18.1 IC5.2)
V_REG_3V: SOC nRF52832 (9 pins), Sensors (9 pins), LED & Button (C19.2 R7.1 R8.2), Power Supply (C1.2 IC1.1 R1.2), RTC (C18.2 IC5.5 R11.2)
BAT_ADC: SOC nRF52832 (IC3.7), Power Supply (R9.1 R10.2)
I2C_SCL: SOC nRF52832 (IC3.12 J4.1 R4.1), Sensors (B2.2 IC6.2 IC7.A2), RTC (IC5.7)
I2C_SDA: SOC nRF52832 (IC3.11 J3.1 R3.1), Sensors (B2.4 IC6.1 IC7.B2), RTC (IC5.8)
LED_RED_EN: SOC nRF52832 (IC3.10), LED & Button (IC4.1 R12.2)
PB_INT: SOC nRF52832 (IC3.24 R6.2), LED & Button (C19.1 R8.1 S1.2)
RTC_INT: SOC nRF52832 (IC3.9), RTC (IC5.4 R11.1)